# Altium schematic sheet Low Distortion Oscillator.Osc.SchDoc
size A4
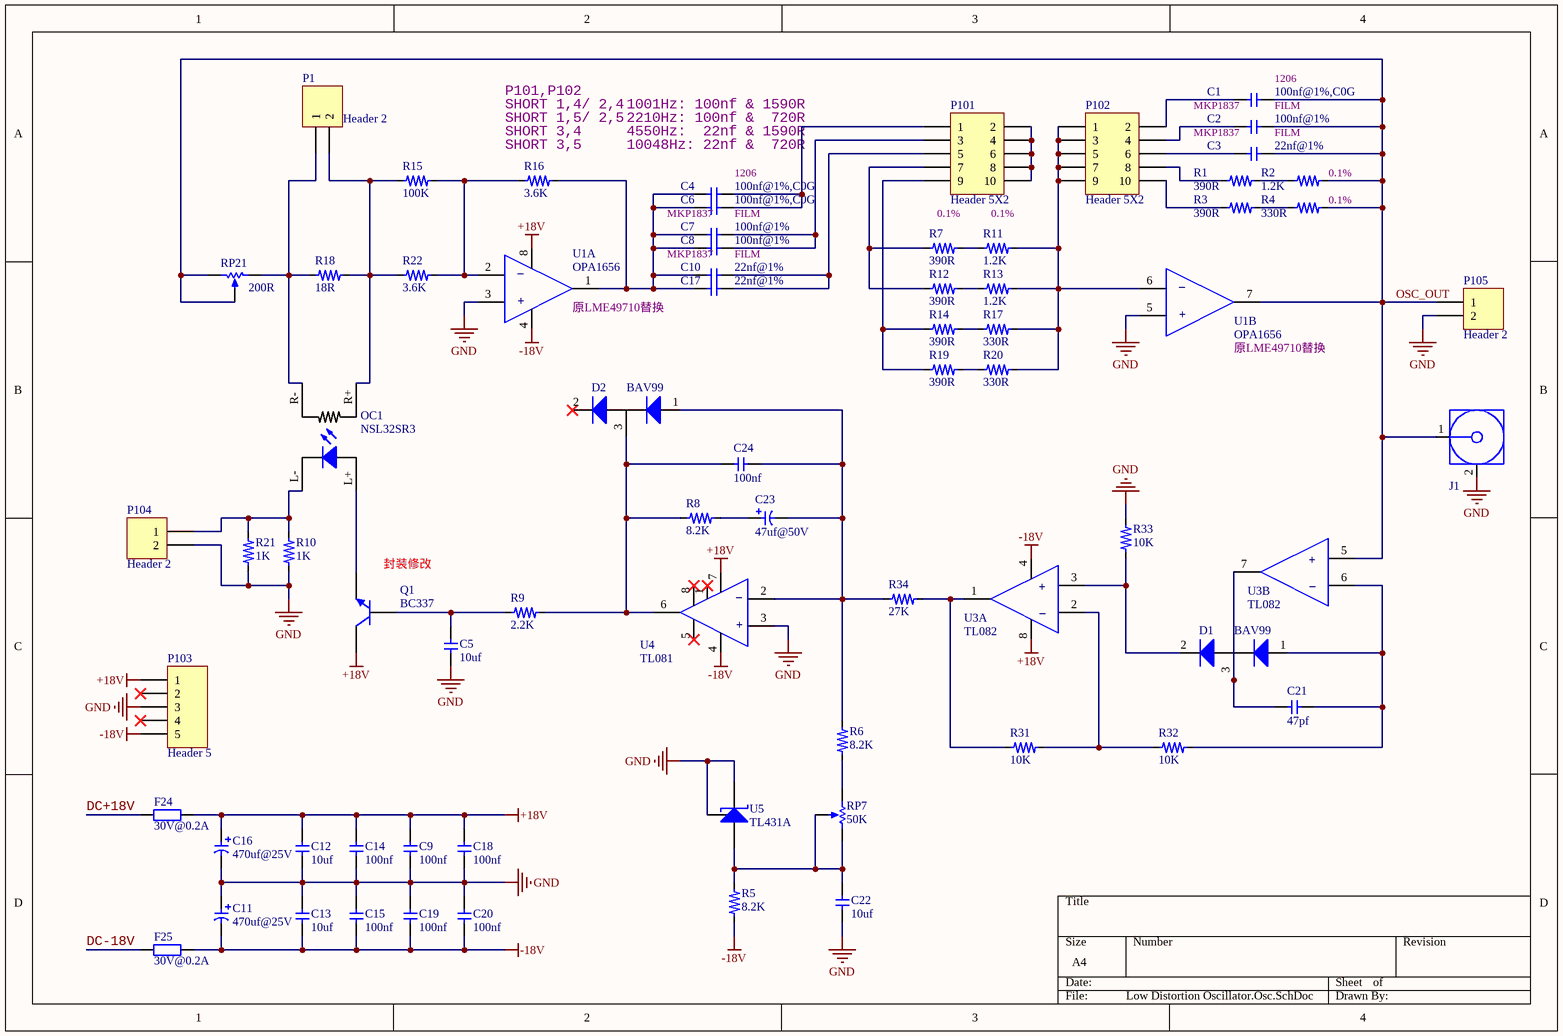
[diagram p0: Low Distortion Oscillator.Osc.SchDoc]

## Parts
C1  value 100nf@1%,C0G  [C1206]  (hidden comment: Cap)
C2  value 100nf@1%  [CAP-FILM-7.2X8.5X10-P5X0.5]  (hidden comment: Cap-Film)
C3  value 22nf@1%  [CAP-FILM-7.2X5.5X7.0-P5X0.5]  (hidden comment: Cap-Film)
C4  value 100nf@1%,C0G  [C1206]  (hidden comment: Cap)
C5  value 10uf  [C0805]  (hidden comment: Cap)
C6  value 100nf@1%,C0G  [C1206]  (hidden comment: Cap)
C7  value 100nf@1%  [CAP-FILM-7.2X8.5X10-P5X0.5]  (hidden comment: Cap-Film)
C8  value 100nf@1%  [CAP-FILM-7.2X8.5X10-P5X0.5]  (hidden comment: Cap-Film)
C9  value 100nf  [C0805]  (hidden comment: Cap)
C10  value 22nf@1%  [CAP-FILM-7.2X5.5X7.0-P5X0.5]  (hidden comment: Cap-Film)
C11  value 470uf@25V  [C8X12]  (hidden comment: Cap2)
C12  value 10uf  [C1206]  (hidden comment: Cap)
C13  value 10uf  [C1206]  (hidden comment: Cap)
C14  value 100nf  [C0805]  (hidden comment: Cap)
C15  value 100nf  [C0805]  (hidden comment: Cap)
C16  value 470uf@25V  [C8X12]  (hidden comment: Cap2)
C17  value 22nf@1%  [CAP-FILM-7.2X5.5X7.0-P5X0.5]  (hidden comment: Cap-Film)
C18  value 100nf  [C0805]  (hidden comment: Cap)
C19  value 100nf  [C0805]  (hidden comment: Cap)
C20  value 100nf  [C0805]  (hidden comment: Cap)
C21  value 47pf  [C0805]  (hidden comment: Cap)
C22  value 10uf  [C0805]  (hidden comment: Cap)
C23  value 47uf@50V  [C6.3X11]  (hidden comment: Cap2)
C24  value 100nf  [C0805]  (hidden comment: Cap)
D1  BAV99  [BAV99-SOT23]
D2  BAV99  [BAV99-SOT23]
F24  value 30V@0.2A  [F1210]  (hidden comment: Fuse)
F25  value 30V@0.2A  [F1210]  (hidden comment: Fuse)
J1  SMA  [SMA-2]  (value not drawn)
OC1  NSL32SR3  [NSL32SR3]
P1  Header 2  [HDR1X2]
P101  Header 5X2  [HDR2X5]
P102  Header 5X2  [HDR2X5]
P103  Header 5  [HDR1X5]
P104  Header 2  [HDR1X2]
P105  Header 2  [HDR1X2]
Q1  BC337  [NPN-TO92-CBE]
R1  value 390R  [R0805]  (hidden comment: Res)
R2  value 1.2K  [R0805]  (hidden comment: Res)
R3  value 390R  [R0805]  (hidden comment: Res)
R4  value 330R  [R0805]  (hidden comment: Res)
R5  value 8.2K  [R0805]  (hidden comment: Res)
R6  value 8.2K  [R0805]  (hidden comment: Res)
R7  value 390R  [R0805]  (hidden comment: Res)
R8  value 8.2K  [R0805]  (hidden comment: Res)
R9  value 2.2K  [R0805]  (hidden comment: Res)
R10  value 1K  [R1206]  (hidden comment: Res)
R11  value 1.2K  [R0805]  (hidden comment: Res)
R12  value 390R  [R0805]  (hidden comment: Res)
R13  value 1.2K  [R0805]  (hidden comment: Res)
R14  value 390R  [R0805]  (hidden comment: Res)
R15  value 100K  [R0805]  (hidden comment: Res)
R16  value 3.6K  [R0805]  (hidden comment: Res)
R17  value 330R  [R0805]  (hidden comment: Res)
R18  value 18R  [R0805]  (hidden comment: Res)
R19  value 390R  [R0805]  (hidden comment: Res)
R20  value 330R  [R0805]  (hidden comment: Res)
R21  value 1K  [R1206]  (hidden comment: Res)
R22  value 3.6K  [R0805]  (hidden comment: Res)
R31  value 10K  [R0805]  (hidden comment: Res)
R32  value 10K  [R0805]  (hidden comment: Res)
R33  value 10K  [R0805]  (hidden comment: Res)
R34  value 27K  [R0805]  (hidden comment: Res)
RP7  value 50K  [RP-3296W]  (hidden comment: Res Pot)
RP21  value 200R  [RP-3296W]  (hidden comment: Res Pot)
U1  OPA1656  [OPA1612-SOIC8]  (parts A,B of 2)
U3  TL082  [OPAMP-SOIC8]  (parts A,B of 2)
U4  TL081  [OPAMP-SOIC8]
U5  TL431A  [TL431-SOIC-8]

## Nets
+18V: C9.2 C12.2 C14.2 C16.1 C18.2 F24.2 P103.1 Q1.C U1.8(+Vs) U3.8(+Vs) U4.7(+Vs)
-18V: C11.2 C13.1 C15.1 C19.1 C20.1 F25.2 P103.5 R5.1 U1.4(-Vs) U3.4(-Vs) U4.4(-Vs)
GND: C5.1 C9.1 C11.1 C12.1 C13.2 C14.1 C15.2 C16.2 C18.1 C19.2 C20.2 C22.1 J1.2(GND) P103.3 P104.2 P105.2 R10.1 R21.1 R33.2 U1.3(+IN_A) U1.5(+IN_B) U4.3(+IN) U5.1(Cathode) U5.8(Ref)
DC+18V: F24.1
DC-18V: F25.1
OSC_OUT: C1.2 C2.2 C3.2 J1.1(Signal) P105.1 R2.2 R4.2 RP21.2(TAP) RP21.3(BOT) U1.7(OUT_B) U3.5(+IN_B)
NetC1_1: C1.1 P102.2
NetC2_1: C2.1 P102.4
NetC3_1: C3.1 P102.6
NetC4_1: C4.1 C6.1 C7.1 C8.1 C10.1 C17.1 R16.2 U1.1(OUT_A)
NetC4_2: C4.2 C6.2 P101.1
NetC5_2: C5.2 Q1.B R9.1
NetC7_2: C7.2 C8.2 P101.3
NetC10_2: C10.2 C17.2 P101.5
NetC21_1: C21.1 D1.3(K1/A2) U3.7(OUT_B)
NetC21_2: C21.2 D1.1(A1) R32.2 U3.6(-IN_B)
NetC22_2: C22.2 R5.2 RP7.2(TAP) RP7.3(BOT) U5.2(Anode)
NetC23_1: C23.1 R8.2
NetC23_2: C23.2 C24.2 D2.1(A1) R6.2 R34.1 U4.2(-IN)
NetC24_1: C24.1 D2.3(K1/A2) R8.1 R9.2 U4.6(OUTPUT)
NetD1_2: D1.2(K2) R33.1 U3.3(+IN_A)
NetOC1_L+: OC1.L+ Q1.E
NetOC1_L-: OC1.L- P104.1 R10.2 R21.2
NetOC1_R+: OC1.R+ P1.2 R15.1 R18.2 R22.1
NetOC1_R-: OC1.R- P1.1 R18.1 RP21.1(TOP)
NetP101_2: P101.2 P101.4 P101.6 P101.8 P101.10
NetP101_7: P101.7 R7.1 R12.1
NetP101_9: P101.9 R14.1 R19.1
NetP102_1: P102.1 P102.3 P102.5 P102.7 P102.9 R11.2 R13.2 R17.2 R20.2 U1.6(-IN_B)
NetP102_8: P102.8 R1.1
NetP102_10: P102.10 R3.1
NetR1_2: R1.2 R2.1
NetR3_2: R3.2 R4.1
NetR6_1: R6.1 RP7.1(TOP)
NetR7_2: R7.2 R11.1
NetR12_2: R12.2 R13.1
NetR14_2: R14.2 R17.1
NetR15_2: R15.2 R16.1 R22.2 U1.2(-IN_A)
NetR19_2: R19.2 R20.1
NetR31_1: R31.1 R34.2 U3.1(OUT_A)
NetR31_2: R31.2 R32.1 U3.2(-IN_A)

Not connected (* = marked no-connect by the designer): D2 2(K2)*; P103 2* 4*; U4 1(OFFSET_NULL)* 5(NC)* 8(OFFSET_NULL)*

## Notes on the sheet
- SHORT 1,4/ 2,4
- P101,P102
- 1001Hz: 100nf & 1590R
- MKP1837
- (near C1) 1206
- FILM
- SHORT 1,5/ 2,5
- (near R16) SHORT 3,4
- (near R16) SHORT 3,5
- 2210Hz: 100nf &  720R
- 4550Hz:  22nf & 1590R
- 10048Hz: 22nf &  720R
- 1206
- (near R2) 0.1%
- (near C6) MKP1837
- 0.1%
- (near R4) 0.1%
- (near U1) 原LME49710替换
- (near C8) MKP1837
- (near Q1) 封装修改
- (in symbol OP AMP 1#) –; +
- (in symbol OP AMP 2#, part A) +; –
- (in symbol OP AMP 2#, part B) +; –
- (in symbol OPA1612, part A) –; +
- (in symbol OPA1612, part B) –; +

## Library data of the parts
D1 D2 = BAV99: Small Signal Switching Diode, Dual in Series
OC1 = NSL32SR3: This optocoupler, NSL-32SR3, consists of an LED input optically coupled to a photocell. The photocell resistance is high when the LED current is “off” and low resistance when the LED current is “on”.
P1 P104 P105 = Header 2: Header, 2-Pin
P101 P102 = Header 5X2: Header, 5-Pin, Dual row
P103 = Header 5: Header, 5-Pin
Q1 = NPN: NPN General Purpose Amplifier
R1-R22 R31-R34 = Res: 电阻
RP7 RP21 = Res Pot: 电位器
U1 = OPA1612: OPA161x SoundPlus™ High-Performance, Bipolar-Input Audio Operational Amplifiers
U3 = OP AMP 2#: Universal Operational Amplifiers.
U4 = OP AMP 1#: Universal Operational Amplifiers.
U5 = TL431: 精密可编程基准